# Altium schematic sheet ELECTRONIC LOAD.SchDoc
size A4; SheetNumber: 1; SheetTotal: 1
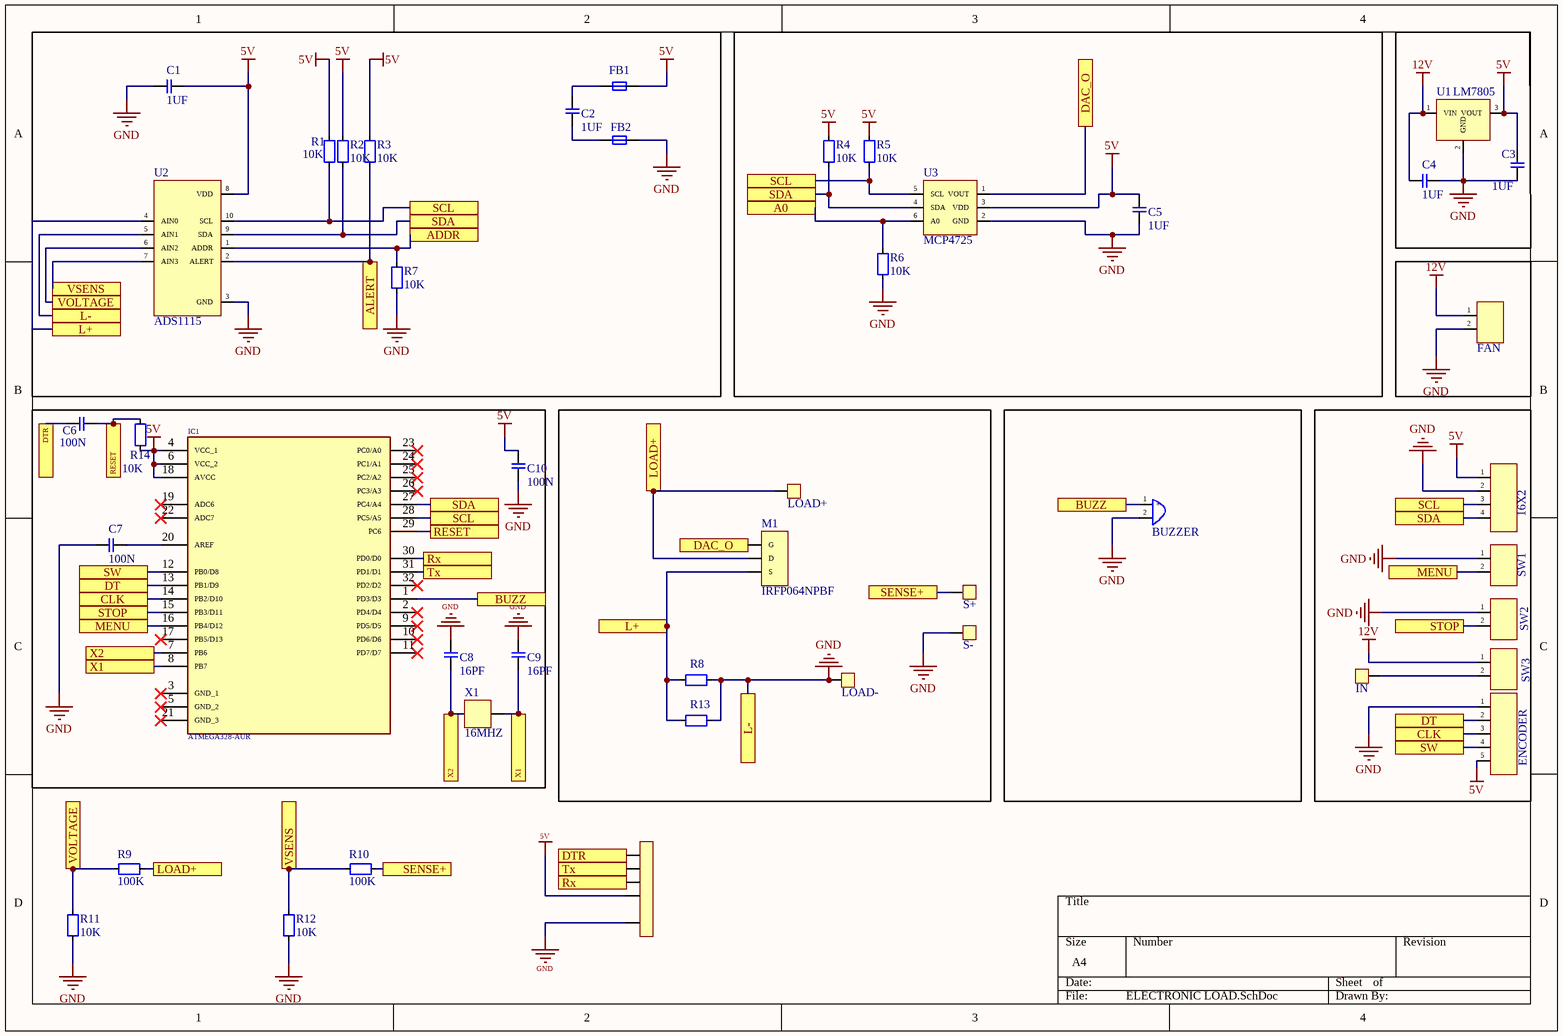
[diagram p0: ELECTRONIC LOAD.SchDoc]

## Parts
16X2  16X2  [4PIN]  (value not drawn)
BUZZER  BUZZER  [BUZZER]  (value not drawn)
C1  1UF  [C-0805W]
C2  1UF  [C-0805W]
C3  1UF  [C-0805W]
C4  1UF  [C-0805W]
C5  1UF  [C-0805W]
C6  100N  [C-0805W]
C7  100N  [C-0805W]
C8  16PF  [C-0805W]
C9  16PF  [C-0805W]
C10  100N  [C-0805W]
ENCODER  ENCODER  [5PIN]  (value not drawn)
FAN  SWITCH  [2PIN]  (value not drawn)
FB1  FB  [R-0603W]  (value not drawn)
FB2  FB  [R-0603W]  (value not drawn)
IC1  ATMEGA328-AUR  [ATMEGA328]
IN  PAD  [PAD]  (value not drawn)
LOAD+  PAD  [PAD]  (value not drawn)
LOAD-  PAD  [PAD]  (value not drawn)
M1  IRFP064NPBF  [TO247]
PIN  PIN  [5PIN]  (value not drawn)
R1  10K  [R-0805W]
R2  10K  [R-0805W]
R3  10K  [R-0805W]
R4  10K  [R-0805W]
R5  10K  [R-0805W]
R6  10K  [R-0805W]
R7  10K  [R-0805W]
R8  2512W  [R-2512W]  (value not drawn)
R9  100K  [R-0805W]
R10  100K  [R-0805W]
R11  10K  [R-0805W]
R12  10K  [R-0805W]
R13  2512W  [R-2512W]  (value not drawn)
R14  10K  [R-0805W]
S+  PAD  [PAD]  (value not drawn)
S-  PAD  [PAD]  (value not drawn)
SW1  SWITCH  [2PIN]  (value not drawn)
SW2  SWITCH  [2PIN]  (value not drawn)
SW3  SWITCH  [2PIN]  (value not drawn)
U1  LM7805  [TO-252]
U2  ADS1115  [ADS1115]
U3  MCP4725  [sot23-6]
X1  16MHZ  [16MHZ CRYSTAL]

## Ports
A0, ADDR, ALERT, BUZZ, CLK, DAC_O, DT, DTR, L+, L-, LOAD+, MENU, RESET, Rx, SCL, SDA, SENSE+, STOP, SW, Tx, VOLTAGE, VSENS, X1, X2

## Nets
5V: 16X2.1 C1.2 C3.2 C5.2 C10.2 ENCODER.5 FB1.2 IC1.4(VCC_1) IC1.6(VCC_2) IC1.18(AVCC) PIN.4 R1.2 R2.2 R3.2 R4.2 R5.2 R14.2 U1.3(VOUT) U2.8(VDD) U3.3(VDD)
12V: C4.1 FAN.1 SW3.1 U1.1(VIN)
GND: 16X2.2 BUZZER.2(-) C1.1 C3.1 C4.2 C5.1 C7.1 C8.2 C9.2 C10.1 ENCODER.1 FAN.2 FB2.2 LOAD-.1 PIN.5 R6.1 R7.1 R8.2 R11.1 R12.1 R13.2 S-.1 SW1.1 SW2.1 U1.2(GND) U2.3(GND) U2.5(AIN1) U3.2(GND) ; port L-
A0: R6.2 U3.6(A0) ; port A0
ADDR: R7.2 U2.1(ADDR) ; port ADDR
ALERT: R3.1 U2.2(ALERT) ; port ALERT
BUZZ: BUZZER.1(+) IC1.1(PD3/D3) ; port BUZZ
CLK: ENCODER.3 IC1.14(PB2/D10) ; port CLK
DAC_O: M1.1(G) U3.1(VOUT) ; port DAC_O
DT: ENCODER.2 IC1.13(PB1/D9) ; port DT
DTR: C6.1 PIN.1 ; port DTR
L+: M1.3(S) R8.1 R13.1 U2.4(AIN0) ; port L+
LOAD+: LOAD+.1 M1.2(D) R9.2 ; port LOAD+
MENU: IC1.16(PB4/D12) SW1.2 ; port MENU
RESET: C6.2 IC1.29(PC6) R14.1 ; port RESET
Rx: IC1.30(PD0/D0) PIN.3 ; port Rx
SCL: 16X2.3 IC1.28(PC5/A5) R1.1 R5.1 U2.10(SCL) U3.5(SCL) ; port SCL
SDA: 16X2.4 IC1.27(PC4/A4) R2.1 R4.1 U2.9(SDA) U3.4(SDA) ; port SDA
SENSE+: R10.2 S+.1 ; port SENSE+
STOP: IC1.15(PB3/D11) SW2.2 ; port STOP
SW: ENCODER.4 IC1.12(PB0/D8) ; port SW
Tx: IC1.31(PD1/D1) PIN.2 ; port Tx
VOLTAGE: R9.1 R11.2 U2.6(AIN2) ; port VOLTAGE
VSENS: R10.1 R12.2 U2.7(AIN3) ; port VSENS
X1: C9.1 IC1.8(PB7) X1.2 ; port X1
X2: C8.1 IC1.7(PB6) X1.1 ; port X2
NetC2_1: C2.1 FB2.1
NetC2_2: C2.2 FB1.1
NetC7_2: C7.2 IC1.20(AREF)
NetIN_1: IN.1 SW3.2

Not connected (* = marked no-connect by the designer): IC1 2(PD4/D4)* 3(GND_1)* 5(GND_2)* 9(PD5/D5)* 10(PD6/D6)* 11(PD7/D7)* 17(PB5/D13)* 19(ADC6)* 21(GND_3)* 22(ADC7)* 23(PC0/A0)* 24(PC1/A1)* 25(PC2/A2)* 26(PC3/A3)* 32(PD2/D2)*

## Library data of the parts
16X2 = 4PIN
BUZZER = BUZZER: YX-YT12075-YT03D
C1-C5 = 1UF CAPACITOR: 0603 CAPACITOR
C6 C7 C10 = 100N CAPACITOR
ENCODER = 5PIN
FAN SW1-SW3 = 2PIN
FB1 FB2 = LCB1608-152Y-N
IC1 = ATMEGA328-AUR: Manufacturer_Name: Microchip; Datasheet Link: https://componentsearchengine.com/Datasheets/1/ATMEGA328-AUR.pdf; Height: 1.2mm; Manufacturer_Part_Number: ATMEGA328-AUR; Mouser Part Number: 556-ATMEGA328-AUR; Mouser Price/Stock: https://www.mouser.co.uk/ProductDetail/Microchip-Technology-Atmel/ATMEGA328-AUR/?qs=lwdSMh1%2FoYLfe%252B5OKFEFrw%3D%3D; Arrow Part Number: ATMEGA328-AUR; Arrow Price/Stock: https://www.arrow.com/en/products/atmega328-aur/microchip-technology
M1 = IRFP064NPBF: TO247
PIN = PIN5
R1-R7 R11 R12 R14 = 10K RESISTOR
R8 R13 = 2512W RESISTOR
U3 = MCP4725: SOT23-6